# Altium schematic sheet microcontroller connector.SchDoc
size A4; SheetNumber: 6; SheetTotal: 6
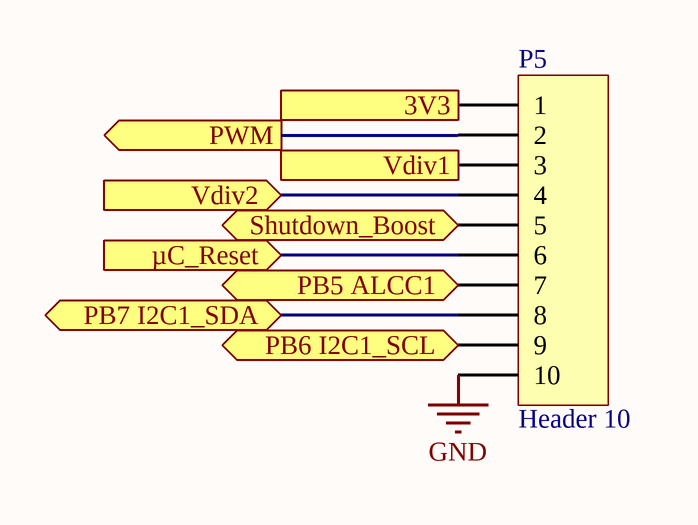
[diagram p0: microcontroller connector.SchDoc]

## Parts
P5  Header 10  [HDR1X10]

## Ports
3V3 (in), PB5 ALCC1 (bidir), PB6 I2C1_SCL (bidir), PB7 I2C1_SDA (bidir), PWM (out), Shutdown_Boost (bidir), Vdiv1 (in), Vdiv2 (in), µC_Reset (in)

## Nets
GND: P5.10
3V3: P5.1 ; port 3V3
PB5 ALCC1: P5.7 ; port PB5 ALCC1
PB6 I2C1_SCL: P5.9 ; port PB6 I2C1_SCL
PB7 I2C1_SDA: P5.8 ; port PB7 I2C1_SDA
PWM: P5.2 ; port PWM
Shutdown_Boost: P5.5 ; port Shutdown_Boost
Vdiv1: P5.3 ; port Vdiv1
Vdiv2: P5.4 ; port Vdiv2
µC_Reset: P5.6 ; port µC_Reset

## Library data of the parts
P5 = Header 10: Header, 10-Pin; LatestRevisionDate: 17-Jul-2002; LatestRevisionNote: Re-released for DXP Platform.; Publisher: Altium Limited